# EAGLE schematic h-bridge v3 (EAGLE 7.7.0)
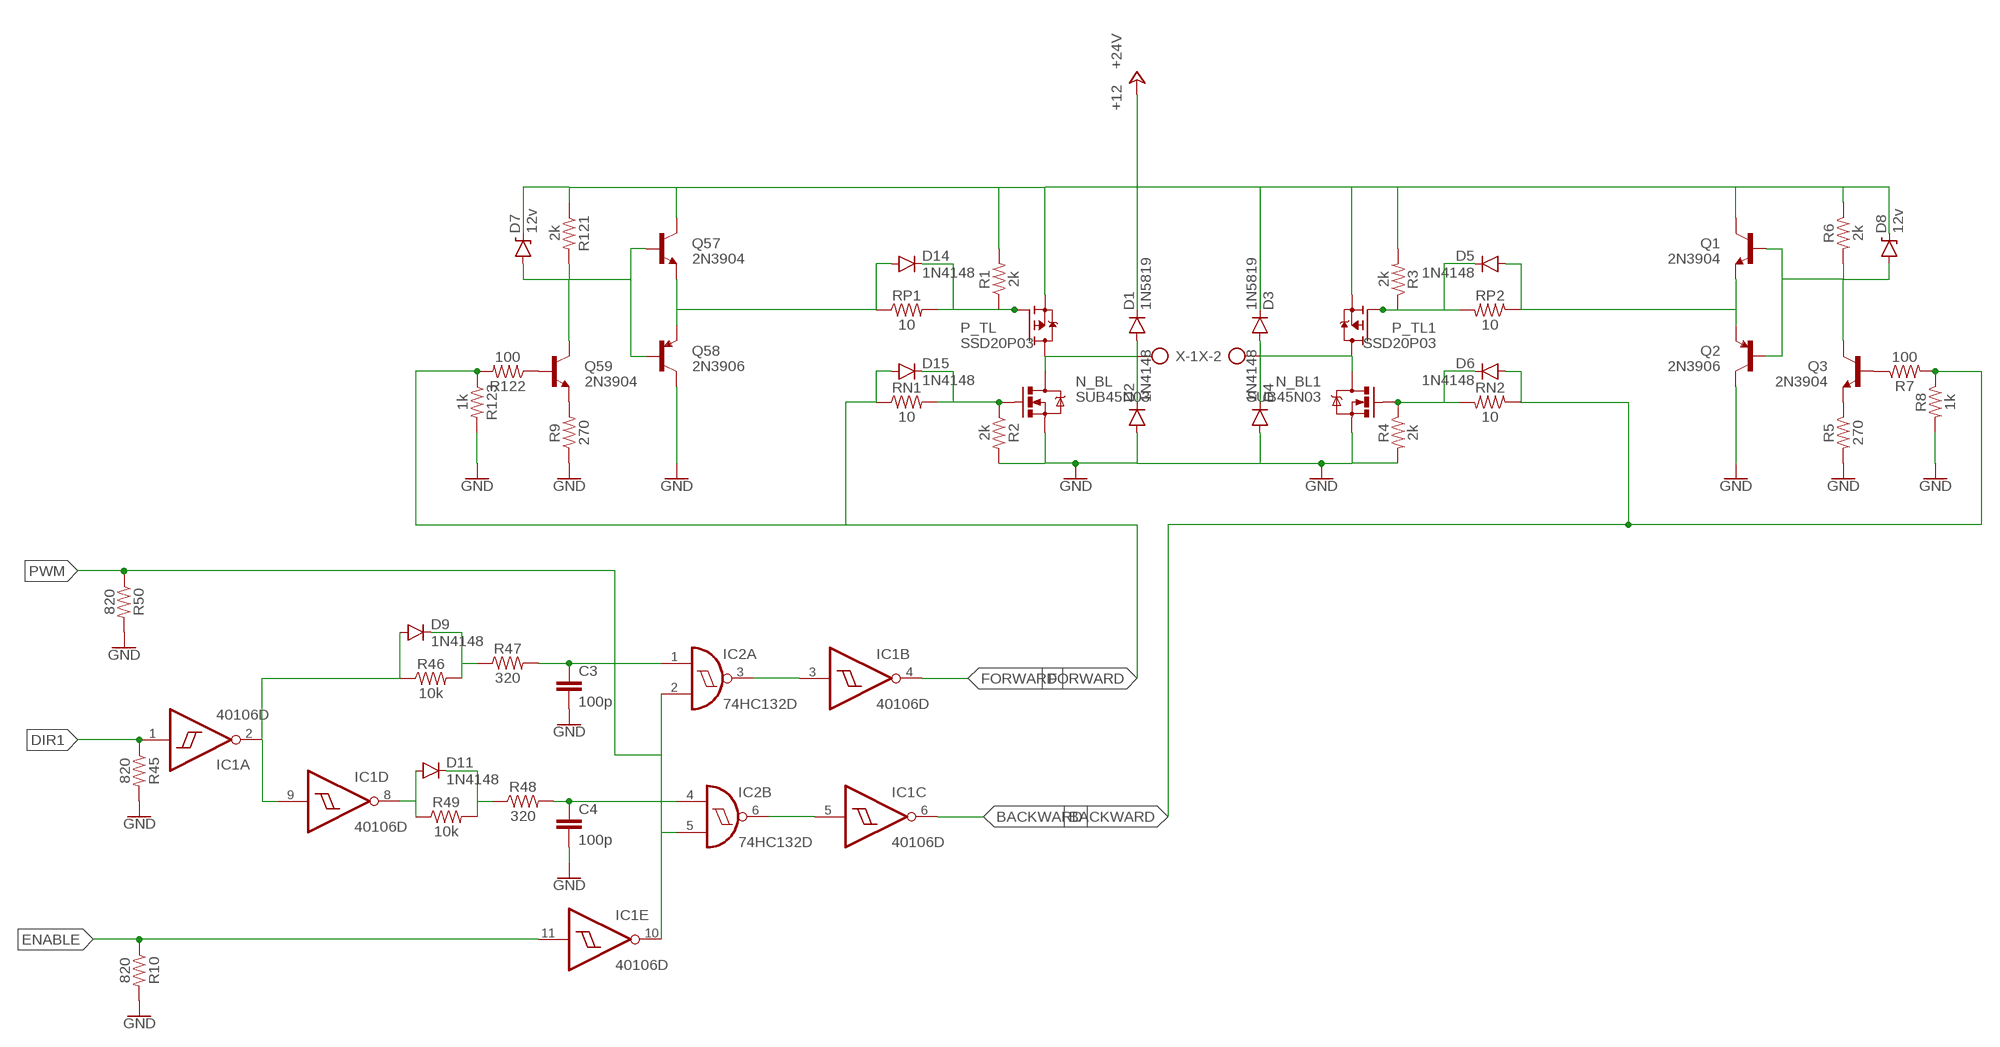
[diagram p0: schematic, sheet 1]

## Parts
C3  100p  1.0UF-25V-+80/-20(0805)"  [0805-CAP]
C4  100p  1.0UF-25V-+80/-20(0805)"  [0805-CAP]
D1  1N5819  DIODESOD123  [SOD-123]
D2  1N4148  DIODESOD123  [SOD-123]
D3  1N5819  DIODESOD123  [SOD-123]
D4  1N4148  DIODESOD123  [SOD-123]
D5  1N4148  DIODESOD123  [SOD-123]
D6  1N4148  DIODESOD123  [SOD-123]
D7  12v  DIODE-ZENER16V  [SOD-123]
D8  12v  DIODE-ZENER16V  [SOD-123]
D9  1N4148  DIODESOD123  [SOD-123]
D11  1N4148  DIODESOD123  [SOD-123]
D14  1N4148  DIODESOD123  [SOD-123]
D15  1N4148  DIODESOD123  [SOD-123]
IC1  40106D  [SO14]
IC2  74HC132D  [SO14]
N_BL  SUB45N03  MOSFET-NCHANNELPSMN7R0  [TO-263/D2PAK]
N_BL1  SUB45N03  MOSFET-NCHANNELPSMN7R0  [TO-263/D2PAK]
P_TL  SSD20P03  FDD4141TO252  [TO252]
P_TL1  SSD20P03  FDD4141TO252  [TO252]
Q1  2N3904  TRANSISTOR_NPNMMBT5088  [SOT23-3]
Q2  2N3906  TRANSISTOR_PNPPMBT3906  [SOT23-3]
Q3  2N3904  TRANSISTOR_NPNMMBT5088  [SOT23-3]
Q57  2N3904  TRANSISTOR_NPNMMBT5088  [SOT23-3]
Q58  2N3906  TRANSISTOR_PNPPMBT3906  [SOT23-3]
Q59  2N3904  TRANSISTOR_NPNMMBT5088  [SOT23-3]
R1  2k  RESISTORAXIAL-0.3  [AXIAL-0.3]
R2  2k  RESISTORAXIAL-0.3  [AXIAL-0.3]
R3  2k  RESISTORAXIAL-0.3  [AXIAL-0.3]
R4  2k  RESISTORAXIAL-0.3  [AXIAL-0.3]
R5  270  RESISTORAXIAL-0.3  [AXIAL-0.3]
R6  2k  RESISTORAXIAL-0.3  [AXIAL-0.3]
R7  100  RESISTORAXIAL-0.3  [AXIAL-0.3]
R8  1k  RESISTORAXIAL-0.3  [AXIAL-0.3]
R9  270  RESISTORAXIAL-0.3  [AXIAL-0.3]
R10  820  RESISTORAXIAL-0.3  [AXIAL-0.3]
R45  820  RESISTORAXIAL-0.3  [AXIAL-0.3]
R46  10k  RESISTORAXIAL-0.3  [AXIAL-0.3]
R47  320  RESISTORAXIAL-0.3  [AXIAL-0.3]
R48  320  RESISTORAXIAL-0.3  [AXIAL-0.3]
R49  10k  RESISTORAXIAL-0.3  [AXIAL-0.3]
R50  820  RESISTORAXIAL-0.3  [AXIAL-0.3]
R121  2k  RESISTORAXIAL-0.3  [AXIAL-0.3]
R122  100  RESISTORAXIAL-0.3  [AXIAL-0.3]
R123  1k  RESISTORAXIAL-0.3  [AXIAL-0.3]
RN1  10  RESISTORAXIAL-0.3  [AXIAL-0.3]
RN2  10  RESISTORAXIAL-0.3  [AXIAL-0.3]
RP1  10  RESISTORAXIAL-0.3  [AXIAL-0.3]
RP2  10  RESISTORAXIAL-0.3  [AXIAL-0.3]
X  SMKDSP_1,5/2  [SMKDSP_1,5/2]

## Nets
+24V: D1.C D3.C D7.C D8.C P_TL1.2(S) P_TL.2(S) Q1.3(C) Q57.3(C) R1.P$2 R3.P$2 R6.P$1 R121.P$1 ; supply symbol labelled +12 +24V
BACKWARD: D6.A IC1.6(C:O) R7.P$2 R8.P$1 RN2.P$1
DIR1: IC1.1(A:I) R45.P$1
DR1: D5.A Q1.2(E) Q2.2(E) RP2.P$1
ENABLE: IC1.11(E:I) R10.P$1
FORWARD: D15.A IC1.4(B:O) R122.P$2 R123.P$1 RN1.P$1
GND: C3.2 C4.2 D2.A D4.A N_BL1.3(S) N_BL.3(S) Q2.3(C) Q58.3(C) R2.P$2 R4.P$2 R5.P$2 R8.P$2 R9.P$1 R10.P$2 R45.P$2 R50.P$2 R123.P$2
INV_SIG1: D8.A Q1.1(B) Q2.1(B) Q3.3(C) R6.P$2
INV_SIG3: D7.A Q57.1(B) Q58.1(B) Q59.3(C) R121.P$2
N$1: D1.A D2.C N_BL.2(D) P_TL.3(D) X.1
N$2: D6.C N_BL1.1(G) R4.P$1 RN2.P$2
N$3: D5.C P_TL1.1(G) R3.P$1 RP2.P$2
N$4: D3.A D4.C N_BL1.2(D) P_TL1.3(D) X.2
N$5: Q3.1(B) R7.P$1
N$6: Q3.2(E) R5.P$1
N$7: D14.A Q57.2(E) Q58.2(E) RP1.P$1
N$8: Q59.2(E) R9.P$2
N$33: D9.A IC1.2(A:O) IC1.9(D:I) R46.P$1
N$34: D9.C R46.P$2 R47.P$1
N$35: C3.1 IC2.1(A:I0) R47.P$2
N$36: IC1.3(B:I) IC2.3(A:O)
N$37: IC1.5(C:I) IC2.6(B:O)
N$39: C4.1 IC2.4(B:I0) R48.P$2
N$40: D11.C R48.P$1 R49.P$2
N$41: D11.A IC1.8(D:O) R49.P$1
N$44: D15.C N_BL.1(G) R2.P$1 RN1.P$2
N$45: D14.C P_TL.1(G) R1.P$1 RP1.P$2
N$109: Q59.1(B) R122.P$1
PWM: IC1.10(E:O) IC2.2(A:I1) IC2.5(B:I1) R50.P$1
Unconnected: IC1.12(F:O) IC1.13(F:I) IC2.8(C:O) IC2.9(C:I0) IC2.10(C:I1) IC2.11(D:O) IC2.12(D:I0) IC2.13(D:I1)

## Power pins joined to a net without a drawn wire
GND: IC2.7(P:GND)
VCC: IC2.14(P:VCC)
VDD: IC1.14(P:VDD)
VSS: IC1.7(P:VSS)

## Library data of the parts
C3 C4 = SparkFun-Capacitors:1.0UF-25V-+80/-20(0805): CAP-11625
D1-D6 D9 D11 D14 D15 = SparkFun-DiscreteSemi:DIODE: Diode These are standard reverse protection diodes and small signal diodes. SMA package can handle up to about 1A. SOD-323 can handle about 200mA. What the SOD-323 package when ordering, there are some mfgs out there that are 5-pin packages.
D7 D8 = SparkFun-DiscreteSemi:DIODE-ZENER: Zener Diode Production Part - 8199 3.4V Zener Voltage; PROD_ID: DIO-12440; VALUE: 16V
IC1 = 40xx:40106: Hex SCHMITT TRIGGER
IC2 = 74xx-eu:74*132: Quad 2-input NAND schmitt trigger
N_BL N_BL1 = SparkFun-DiscreteSemi:MOSFET-NCHANNEL: Common NMOSFET Parts MFG P/N Store ID Prod ID FDD8780 TRANS-09984 SI7820DN TRANS-11055 FDS6630A IC-08089 2N7002PW TRANS-11151 FQP30N06L COM-10213 TRANS-10060 BSS123LT1G TRANS-08345 BSS138 TRANS-00830 BS170 2N7000; PROD_ID: TRANS-12437; VALUE: 100A/100V
P_TL P_TL1 = transistor-fet:FDD4141: P-Channel PowerTrench® MOSFET Source: FDD4141.pdf
Q1 Q3 Q57 Q59 = SparkFun-DiscreteSemi:TRANSISTOR_NPN: Generic NPN BJT MMBT2222A - TRANS-08049 (SOT-23, 1A 40V) MPSA42 - TRANS-09116 (SOT-23, 500mA 300V) MMBT5088LT1G - TRANS-11160 (SOT-23, 50 mA 30V) BC547 - COM-08928 <http://www.sparkfun.com/products/8928> (TO-92 45V 100mA) (1.Collector 2.Base 3.Emitter) 2N3904 - COM-00521 <http://www.sparkfun.com/products/521> (TO-92 40V 200mA) (1.Emitter 2.Base 3.Collector) P2N2222A - COM-12852 <http://www.sparkfun.com/products/12852> (TO-92 40V 600mA) (1.Collector 2.Base 3.Emitter); PROD_ID: TRANS-11160; VALUE: MMBT5088
Q2 Q58 = SparkFun-DiscreteSemi:TRANSISTOR_PNP: Generic PNP BJT Double check pinouts against datasheets- not all devices are the same! MMBT3906 - 40V 200mA SOT-23 (TRANS-08052) MMBT4403 - 40V 600mA SOT-23 (TRANS-09245); PROD_ID: TRANS-08052; VALUE: PMBT3906
R1-R10 R45-R50 R121-R123 RN1 RN2 RP1 RP2 = SparkFun_Resistors:RESISTOR: Generic Resistor Package
X = con-phoenix-smkdsp:SMKDSP_1,5/2: Printklemme, Nennstrom: 17,5 A, Bemessungsspannung: 250 V, Raster: 5,0 mm Source: http://eshop.phoenixcontact.de .. 1733415.pdf; MF: FARNELL; MPN: 1733570; OC_FARNELL: 3041244; OC_NEWARK: 69C8588